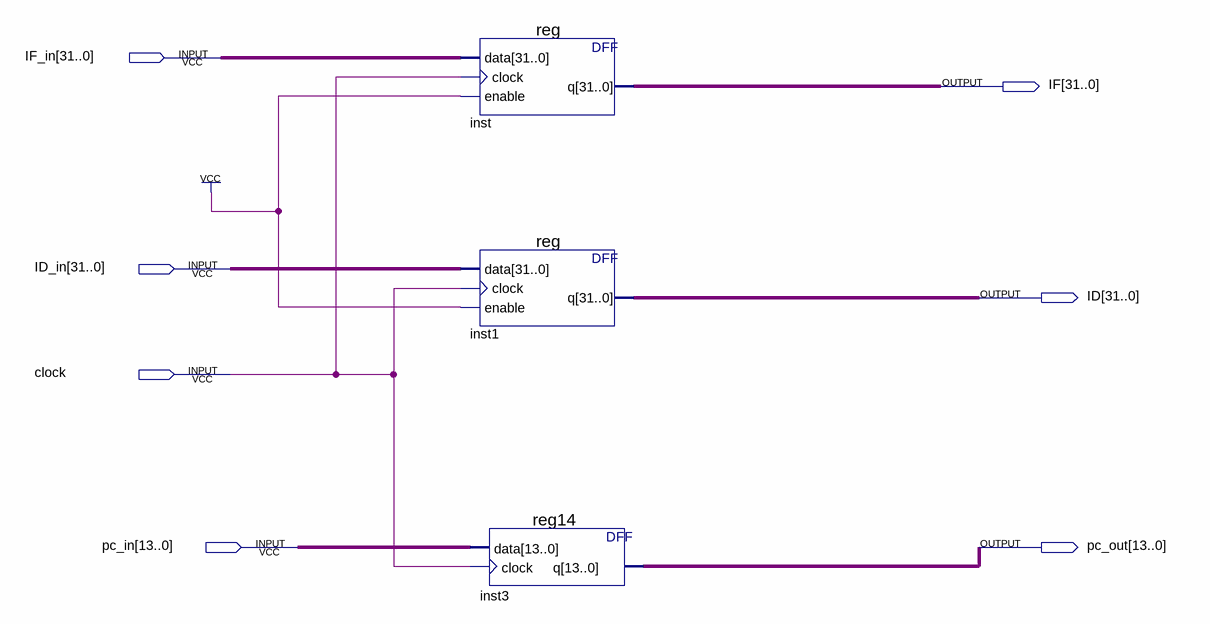
[diagram p0: schematic sheet]
// Quartus schematic IFID.bdf as structural Verilog: 3 symbols, 7 pins
module IFID (
  input  [31:0] IF_in,
  input  [31:0] ID_in,
  input  clock,
  input  [13:0] pc_in,
  output [31:0] IF,
  output [31:0] ID,
  output [13:0] pc_out
);

  \reg  inst (.data(IF_in), .clock(clock), .enable(1'b1), .q(IF));
  \reg  inst1 (.data(ID_in), .clock(clock), .enable(1'b1), .q(ID));
  reg14 inst3 (.data(pc_in), .clock(clock), .q(pc_out));
endmodule
